# EasyEDA Pro project MyWeld-ESP32.eprj

# Schematic Sheet1-ascii
Board Name: Sheet1-ascii; Create Date: 2026-03-16; Page Name: Sheet1-with-IR4427; Project Name: MyWeld-ESP32; Schematic Name: Sheet1-ascii; Update Date: 2026-03-17; Address1: *; Address2: *; Address3: *; Address4: *; Application_BuildNumber: *; ApprovedBy: *; Author: Hisham2630; CheckedBy: *; CompanyName: *; CurrentDate: *; CurrentTime: *; Date: *; DocumentFullPathAndName: *; DocumentName: *; DocumentNumber: *; DrawnBy: Hisham2630; Engineer: Hisham2630; ImagePath: *; ModifiedDate: *; Organization: *; ProjectName: *; Revision: A; Rule: *; SheetNumber: 1; SheetTotal: 1; Time: *; Title: DIY Supercapacitor Spot Welder – Inspired by AKA KASYAN, Modified Design
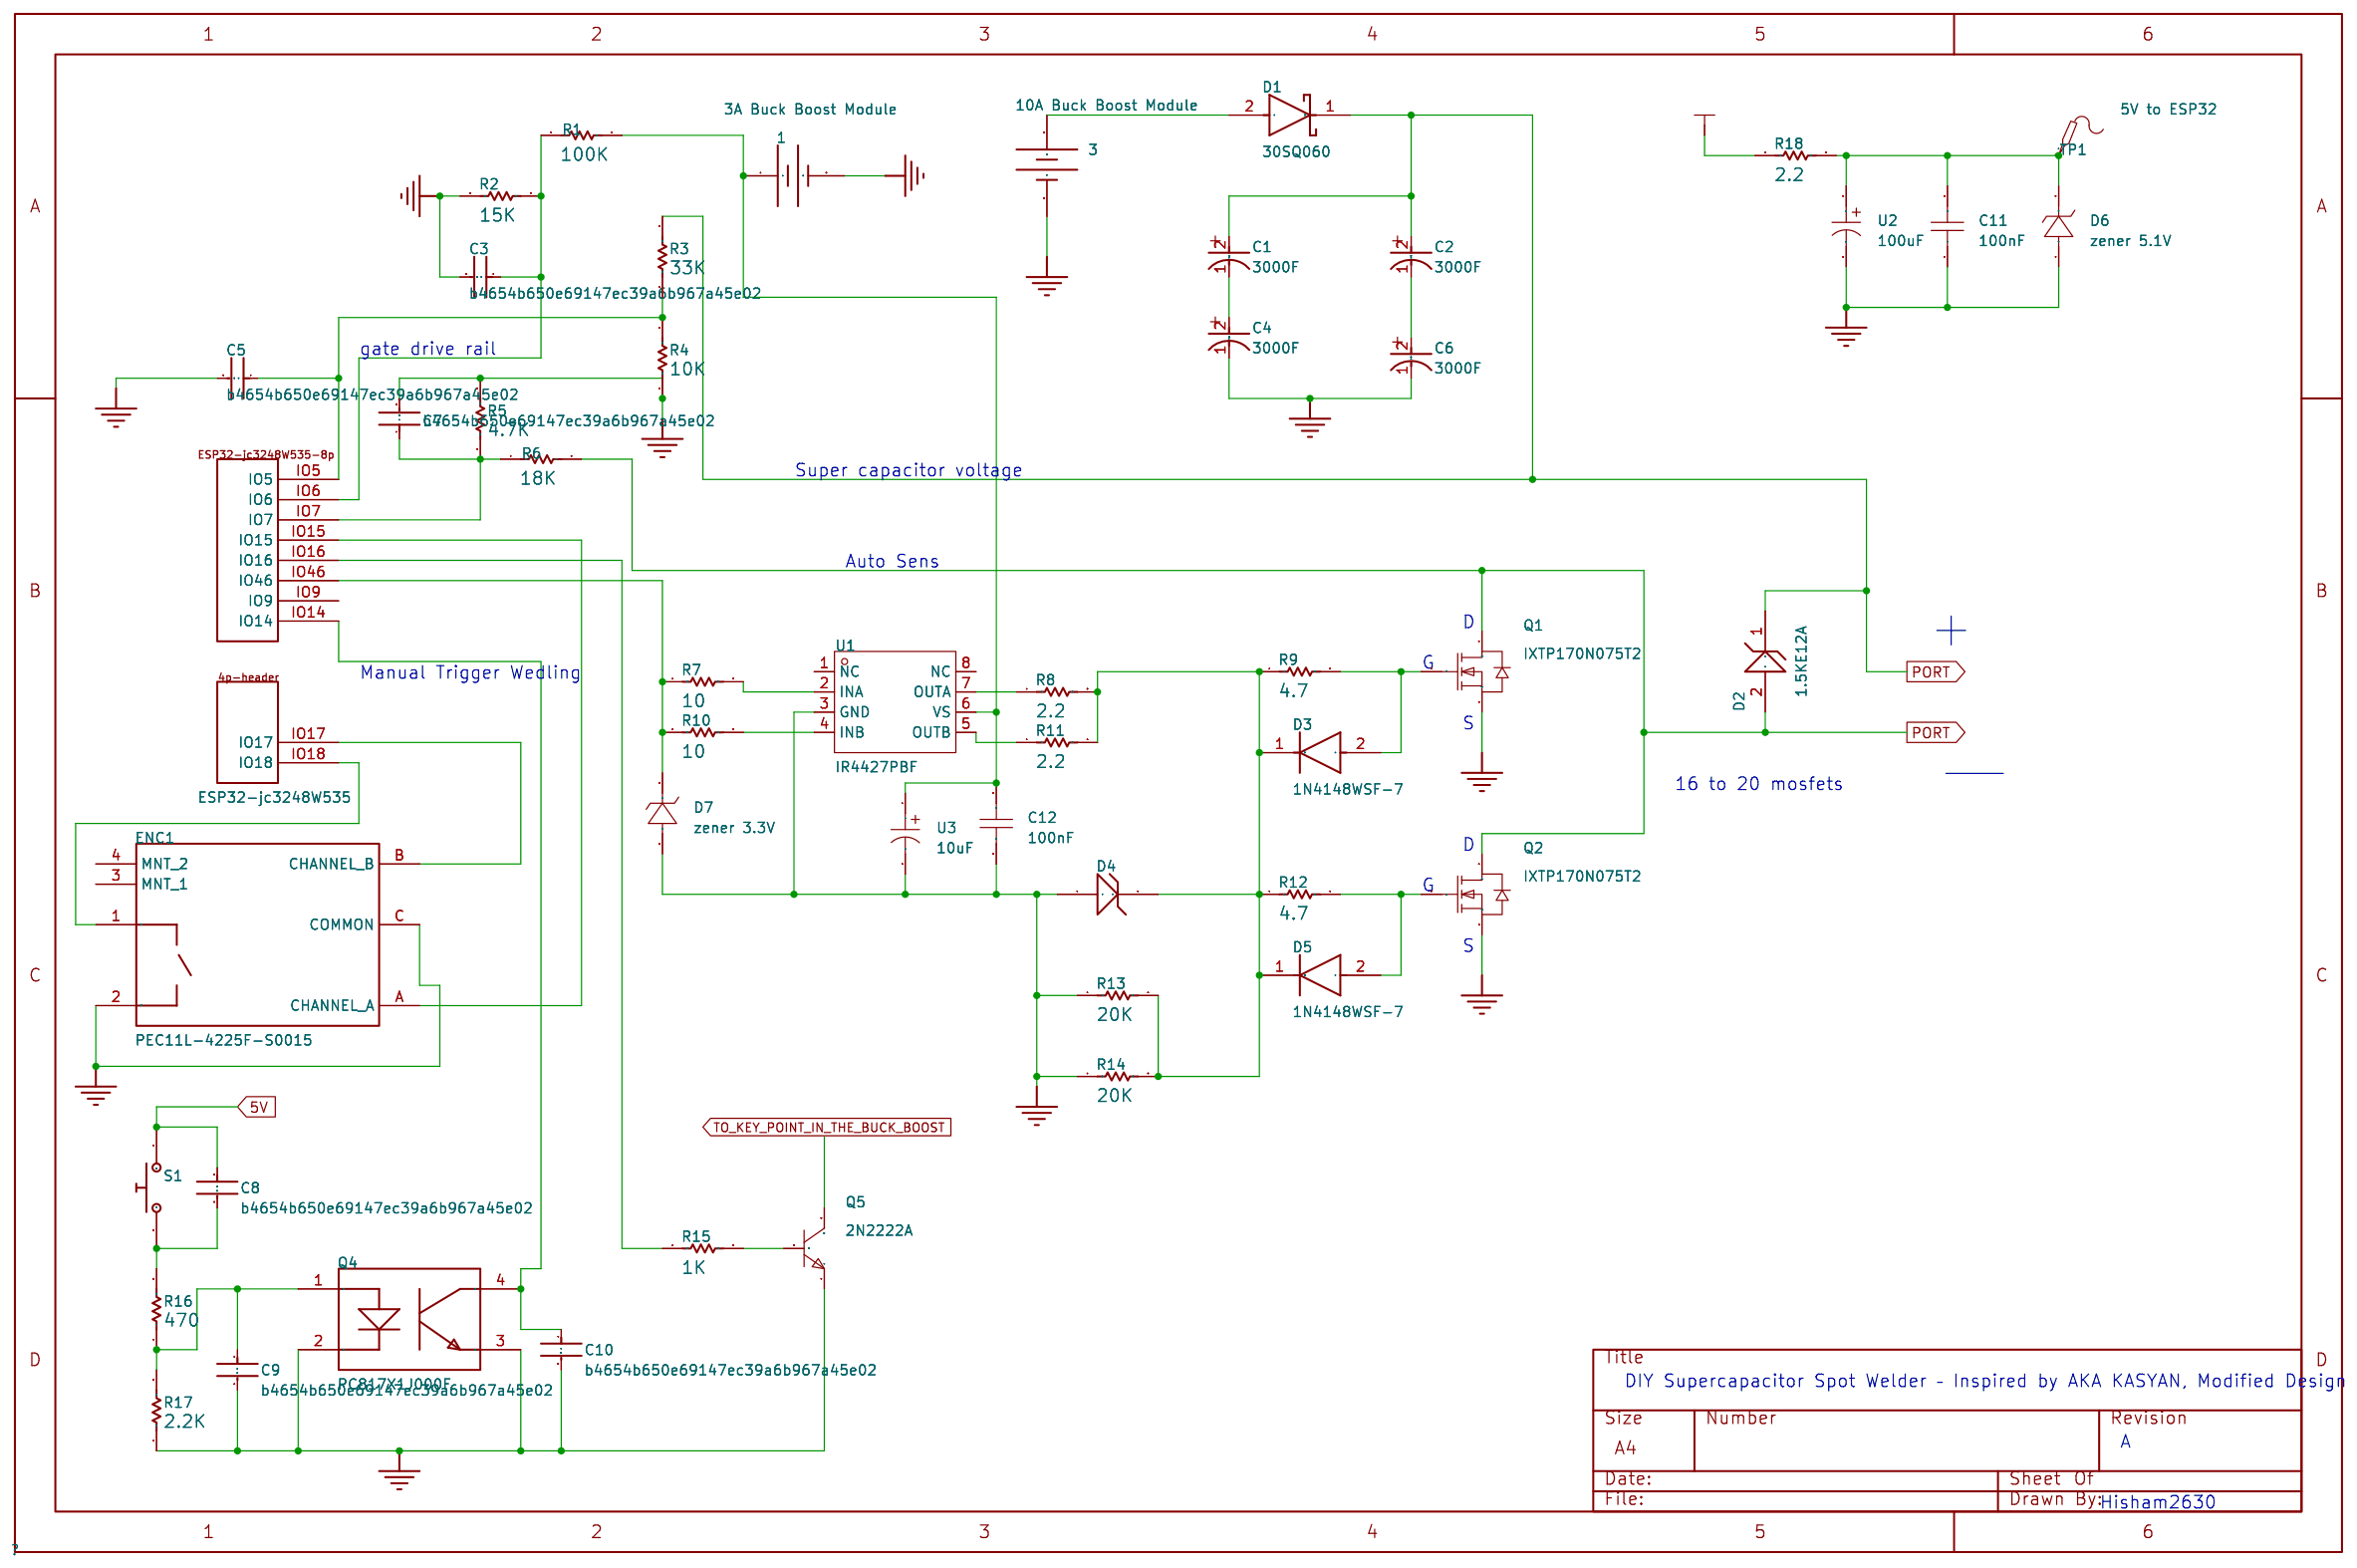
[diagram p0: schematic sheet]

## Parts
1  3A Buck Boost Module
3  10A Buck Boost Module
*1  ESP32-jc3248W535
C1  0.47F
C2  0.47F
C3  b4654b650e69147ec39a6b967a45e02
C4  0.47F
C5  b4654b650e69147ec39a6b967a45e02
C6  0.47F
C7  b4654b650e69147ec39a6b967a45e02
C8  b4654b650e69147ec39a6b967a45e02
C9  b4654b650e69147ec39a6b967a45e02
C10  b4654b650e69147ec39a6b967a45e02
C11  100nF  [C0402]
C12  100nF  [C0402]
D1  30SQ060
D2  1.5KE12A
D3  1.5pF
D4  Zener Diode
D5  1.5pF
D6  zener 5.1V  [LL-34_L3.5-W1.5-R-RD]
D7  zener 3.3V  [LL-34_L3.5-W1.5-R-RD]
ENC1  PEC11L-4225F-S0015
Q1  IXTP170N075T2  [TO-220-3_L10.0-W4.5-P2.54-L-1]
Q2  IXTP170N075T2  [TO-220-3_L10.0-W4.5-P2.54-L-1]
Q4  PC817X1J000F
Q5  2N2222A  [TO-92-3_L4.5-W3.5-P1.27-L]
R1  100K
R2  15K
R3  33K
R4  10K
R5  4.7K
R6  18K
R7  10
R8  2.2
R9  4.7
R10  10
R11  2.2
R12  4.7
R13  20K
R14  20K
R15  1K
R16  470
R17  2.2K
R18  2.2
S1  Push Button Normally Opened
TP1  5V to ESP32  [Test-Point-0.5mm]
U1  IR4427PBF  [PDIP-8_L9.6-W6.4-P2.54-LS7.6-BL]
U2  100uF  [CAP-TH_BD10.0-P5.00-D0.6-FD]
U3  10uF  [CAP-TH_BD10.0-P5.00-D0.6-FD]

## Library data of the parts
1 = 3A Buck Boost Module: Constant Voltage Source; SimulationGenericComponent: True; DC Magnitude: 16V; Design Item ID: Battery; Library Name: Simulation Generic Components
3 = 10A Buck Boost Module: Constant Voltage Source; SimulationGenericComponent: True; DC Magnitude: 5.7V; Design Item ID: Battery; Library Name: Simulation Generic Components
*1 = ESP32-jc3248W535: Library Name: esp32-jc3248W535
C1 C2 C4 C6 = 3000F: CAP 470MF -20% +80% 5.5V T/H; Octopart: https://octopart.com/ft0h474zf-kemet-30531665; Manufacturer: KEMET; Automotive: No; Device Class L3: Supercapacitors; Digikey Description: CAP 470MF -20% +80% 5.5V T/H; ComponentLink2Description: Datasheet; ComponentLink2URL: https://content.kemet.com/datasheets/KEM_S6014_FT.pdf; Device Class L1: Passive Components; Tolerance: -20/+80%; Manufacturer Part Number: FT0H474ZF; Height: 13mm; Category: Cap; RoHS: TRUE; Lead Free: Yes; Temperature Range Low: -40°C; Temperature: -40°C to +85°C; Voltage Rating: 5.5V; Device Class L2: Capacitors; Package1: FT0H474ZF; Mouser Description: Supercapacitors / Ultracapacitors 0.47F 5.5volts Radial Super Cap; Temperature Range High: +85°C; Design Item ID: CMP-03024-000001-1; Library Name: Altium Content Vault; Datasheet: https://content.kemet.com/datasheets/KEM_S6014_FT.pdf
C3 C5 C7-C10 = b4654b650e69147ec39a6b967a45e02: Chip Multilayer Ceramic Capacitors for General Purpose, 0201, 0.10uF, X5R, 15%, 10%, 10V; Mount: Surface Mount; Dielectric: X5R; Width: 0.012inch; Tolerance: 10%; Radiation Hardening: No; Voltage Rating: 10V; REACH SVHC: No SVHC; Height: 0.3mm; Max Operating Temperature: 85°C; Voltage Rating (DC): 10V; Capacitance: 100nF; Thickness: 0.013inch; Termination: SMD/SMT; Lead Free: Lead Free; Package Quantity: 1; Case/Package: 0201; Min Operating Temperature: -55°C; Weight: 6E-06oz; Length: 0.6mm; Case Code (Imperial): 0201; Depth: 0.3mm; Voltage: 10V; Packaging: Tape and Reel; Case Code (Metric): 0603; Origin Footprint 1: FP-GRM033-0_03-MFG; Origin Footprint 2: FP-GRM033-0_03-IPC_B; Origin Footprint 3: FP-GRM033-0_03-IPC_A; Design Item ID: CMP-2010-01264-2; Library Name: Altium Content Vault
C11 C12 = CL05B104KB54PNC: LCSC Part Name: 100nF ±10% 50V; Supplier Part: C307331; Manufacturer: SAMSUNG(三星); Supplier Footprint: 0402; JLCPCB Part Class: Basic Part; Datasheet: https://item.szlcsc.com/datasheet/CL05B104KB54PNC/291005.html; Supplier: LCSC; Tolerance: ±10%; Voltage Rating: 50V; Temperature Coefficient: X7R
D1 = 30SQ060: DIODE SCHOTTKY 20V 1A SMAF; Average Rectified Current: 1A; Packaging: Tape and Reel; Mount: Surface Mount; Max Reverse Voltage (DC): 20V; RoHS Compliant: Yes; Design Item ID: CMP-12790-000092-1; Library Name: Altium Content Vault
D2 = 1.5KE12A: TVS diode [Würth Elektronik] 824520700 TVS diode; Packaging: Cut Tape; Min Breakdown Voltage: 8.19V; Length: 4.32mm; Number of Pins: 2; Width: 3.62mm; Height: 2.4mm; REACH SVHC: Unknown; Breakdown Voltage: 8.19V; Peak Pulse Current: 50A; RoHS: Compliant; Composition: Zener; Reverse Standoff Voltage: 7V; Power Line Protection: No; Number of Unidirectional Channels: 1; Mount: Surface Mount; Polarity: Unidirectional; Peak Pulse Power: 600W; Max Operating Temperature: 150°C; Min Operating Temperature: -65°C; Max Breakdown Voltage: 8.19V; Leakage Current: 200µA; Clamping Voltage: 12V; Design Item ID: CMP-03913-71101605-2; Library Name: Altium Content Vault
D3 D5 = 1N4148WSF-7: DIODE GEN PURP 100V 250MA SOD323; Height: 0.75mm; Digikey Description: DIODE GEN PURP 100V 250MA SOD323; Automotive: No; Footprint Url: https://www.diodes.com/assets/Package-Files/SOD323F.pdf; Category: Diode; Max Repetitive Reverse Voltage: 100V; Lead Free: Yes; Temperature Range High: +150°C; Forward Current: 250mA; Reverse Voltage: 100V; Device Class L3: Rectifier Diodes; ComponentLink2URL: https://www.diodes.com/assets/Datasheets/1N4148WSF.pdf; Package1: SOD323F; Manufacturer: Diodes Inc.; RoHS: TRUE; Mouser Description: Diodes - General Purpose, Power, Switching 200mW 2pF 75Vrrm 150mA 2A 1VF; Temperature: -55°C to +150°C; Max Surge Forward Current: 0.5A; Device Class L2: Diodes; ComponentLink2Description: Datasheet; Device Class L1: Discrete Semiconductors; Octopart: https://octopart.com/1n4148wsf-7-diodes+inc.-33798544; Peak Reverse Current: 0.5uA; Max Junction Temp: +150°C; Temperature Range Low: -55°C; Design Item ID: CMP-12791-000029-1; Library Name: Altium Content Vault; Datasheet: https://www.diodes.com/assets/Datasheets/1N4148WSF.pdf
D4 = Zener Diode: AF: 1; BV_MAX: 1e99; CJO: 0; CJP: 0; CTA: 0; CTP: 0; EG: 1.11; FC: 0.5; FCS: 0.5; FV_MAX: 1e99; IBV: 0.001; IKF: 0; IKR: 0; IS: 1e-14; ISR: 1e-14; JSW: 0; JTUN: 0; JTUNSW: 0; KEG: 1; KF: 0; LEVEL: 1; MJSW: 0.33; N: 1; NBV: 1; NR: 1; NS: 1; NTUN: 30; PHP: 1; RS: 0; TCV: 0; TLEV: 0; TLEVC: 0; TM1: 0; TM2: 0; TNOM: 27; TPB: 0; TPHP: 0; TRS: 0; TRS2: 0; TT: 0; TTT1: 0; TTT2: 0; VJ: 1; XTI: 3; XTITUN: 3; SimulationGenericComponent: True; BV: 18V Zener; Library Name: Simulation Generic Components
D6 D7 = ZMM5V1PF-M: LCSC Part Name: 耐压:5.1V 电流:0.1uA@1V; Supplier Part: C7497480; Manufacturer: ST(先科); Supplier Footprint: LL-34; JLCPCB Part Class: Extended Part; Datasheet: https://item.szlcsc.com/datasheet/ZMM5V1PF-M/8566091.html; Supplier: LCSC; Zener Voltage(Nom): 5.1V; Reverse Leakage Current (Ir): 100nA@1V; Zener Voltage(Range): 4.8V~5.4V; Pd - Power Dissipation: 500mW; Impedance(Zzt): 35Ω; Impedance(Zzk): 550Ω
ENC1 = PEC11L-4225F-S0015: ROTARY ENCODER MECHANICAL 15PPR; Length: 29.5mm; Height: 12mm; RoHS Compliant: Yes; Capacitance: 4225F; Min Operating Temperature: -25°C; Pulses per Revolution: 15; Package Quantity: 75; Built in Switch: Yes; Detent: Yes; Encoder Type: Mechanical; Mount: Through Hole; Number of Channels: 2; Max Operating Temperature: 80°C; Orientation: Vertical; Output Type: Quadrature; Termination: PC Pin; Width: 11.8mm; Packaging: Bulk; Design Item ID: CMP-07421-000017-1; Library Name: Altium Content Vault
Q1 Q2 = IXTP170N075T2: Supplier Part: C22419309; Manufacturer: Littelfuse/IXYS; Supplier Footprint: TO-220; JLCPCB Part Class: Extended Part; Datasheet: https://item.szlcsc.com/datasheet/IXTP170N075T2/24042949.html; Supplier: LCSC
Q4 = PC817X1J000F: OPTOISOLATOR 5KV TRANS 4DIP; Collector Emitter Saturation Voltage: 200mV; Min Operating Temperature: -30°C; Number of Pins: 4; Forward Voltage: 1.4V; Radiation Hardening: No; Power Dissipation: 200mW; Input Current: 20mA; Max Collector Current: 50mA; Collector Emitter Breakdown Voltage: 80V; Output Current per Channel: 50mA; Rise Time: 18000ns; Case/Package: DIP; Fall Time: 18000ns; Forward Current: 50mA; Isolation Voltage: 5kV; Number of Elements: 1; Package Quantity: 2000; Reverse Breakdown Voltage: 6V; Max Operating Temperature: 100°C; Packaging: Sleeve; Max Input Current: 50mA; Output Voltage: 80V; Max Power Dissipation: 200mW; Mount: Through Hole; Current Transfer Ratio: 600%; Number of Channels: 1; Collector Emitter Voltage (VCEO): 80V; Design Item ID: CMP-65434-000003-1; Library Name: Altium Content Vault
Q5 = 2N2222A_C20616319: LCSC Part Name: NPN 600mA 40V; Supplier Part: C20616319; Manufacturer: HXY MOSFET(华轩阳电子); Supplier Footprint: TO-92; JLCPCB Part Class: Extended Part; Datasheet: https://item.szlcsc.com/datasheet/2N2222A/21982678.html; Supplier: LCSC; type: NPN; Current - Collector(Ic): 600mA; Collector - Emitter Voltage VCEO: 40V; Pd - Power Dissipation: 625mW; DC Current Gain: 300@150mA,10V; Transition frequency(fT): 300MHz; Current - Collector Cutoff: 10nA; Vce Saturation(VCE(sat)): 600mV@500mA,50mA; Operating Temperature: -55℃~+150℃; Emitter-Base Voltage(Vebo): 6V; Number: 1 NPN
R1-R18 = Resistor: TC1: 0; TC2: 0; SimulationGenericComponent: True; Library Name: Simulation Generic Components
S1 = Push Button Normally Opened: closed: 0; Rclosed: 1m; Ropen: 1Meg; SimulationGenericComponent: True; Design Item ID: Push Button NO; Library Name: Simulation Generic Components
TP1 = Test-Point
U1 = IR4427PBF: Supplier Part: C1549365; Manufacturer: Infineon(英飞凌); Supplier Footprint: PDIP-8; JLCPCB Part Class: Extended Part; Datasheet: https://atta.szlcsc.com/upload/public/pdf/source/20200522/C537736_3DC1FE819CD879B59A475D2024F6FF95.pdf; Supplier: LCSC; Driven Configuration: 低边; Load Type: MOSFET；IGBT; Number of Drivers: 2; Peak Output Current(sink): 3.3A; Peak Output Current(source): 2.3A; Supply Voltage: 6V~20V; Rise Time: 15ns; Fall Time: 10ns; Operating Temperature: -40℃~+150℃@(Tj)
U2 U3 = 1000uF 16V: Supplier Part: C439782; Manufacturer: Chengx(承兴); Supplier Footprint: 插件,D10xL13mm; JLCPCB Part Class: Extended Part; Datasheet: https://item.szlcsc.com/datasheet/1000uF%252016V/438882.html; Supplier: LCSC; Voltage Rating: 16V; Ripple Current: 680mA@120Hz; Pin Spacing: 5mm; Diameter: 10mm; Height - Seated (Max): 13mm; Lifetime: 2000hrs@105℃; Operating Temperature: -40℃~+105℃

## Nets
5V: C8.1 S1.2
GND: 1.2 3.2 C3.2 C4.1(C) C5.2 C6.1(C) C7.2 C9.2 C10.2 C11.1 C12.1 D4.1(A) D6.1(A) D7.1(A) ENC1.2 ENC1.C(COMMON) Q1.3(S) Q2.3(S) Q4.2(C) Q4.3(E) Q5.1(E) R2.2 R4.1 R5.2 R13.1 R14.1 R17.1 U1.3(GND) U2.2 U3.2
VCC-5V-BUCKBOOST: R18.1
PORT: C1.2(A) C2.2(A) D1.1(C) D2.1(K) D2.2(A) Q1.2(D) Q2.2(D) R3.2 R6.2
Net-(1-1): 1.1 C12.2 R1.2 U1.6(VS) U3.1
Net-(3-1): 3.1 D1.2(A)
Net-(*1-IO5): *1.IO5 C5.1 R3.1 R4.2
Net-(*1-IO6): *1.IO6 C3.1 R1.1 R2.1
Net-(*1-IO7): *1.IO7 C7.1 R5.1 R6.1
Net-(*1-IO14): *1.IO14 C10.1 Q4.4(C)
Net-(*1-IO15): *1.IO15 ENC1.A(CHANNEL A)
Net-(*1-IO16): *1.IO16 R15.1
Net-(*1-IO17): *1.IO17 ENC1.B(CHANNEL B)
Net-(*1-IO18): *1.IO18 ENC1.1
Net-(*1-IO46): *1.IO46 D7.2(K) R7.1 R10.1
Net-(C1-1): C1.1(C) C4.2(A)
Net-(C2-1): C2.1(C) C6.2(A)
Net-(C8-2): C8.2 R16.2 S1.1
Net-(C9-1): C9.1 Q4.1(A) R16.1 R17.2
Net-(C11-2): C11.2 D6.2(K) R18.2 TP1.1 U2.1
Net-(D3-1): D3.1(C) D4.2(K) D5.1(C) R8.2 R9.1 R11.2 R12.1 R13.2 R14.2
Net-(D3-2): D3.2(A) Q1.1(G) R9.2
Net-(D5-2): D5.2(A) Q2.1(G) R12.2
Net-(Q5-2): Q5.2(B) R15.2
Net-(R7-2): R7.2 U1.2(INA)
Net-(R8-1): R8.1 U1.7(OUTA)
Net-(R10-2): R10.2 U1.4(INB)
Net-(R11-1): R11.1 U1.5(OUTB)

Not connected (* = marked no-connect by the designer): *1 IO9; ENC1 3(MNT 1) 4(MNT 2); Q5 3(C); U1 1(NC) 8(NC)

## Notes on the sheet
- gate drive rail
- Super capacitor voltage
- Auto Sens
- D
- +
- Manual Trigger Wedling
- G
- S
- 16 to 20 mosfets
- -
- D
- G
- S
- DIY Supercapacitor Spot Welder – Inspired by AKA KASYAN, Modified Design
- A
- Hisham2630

# Schematic Schematic1
Create Date: 2026-03-17; Page Name: Sheet1-with-TLP358; Project Name: MyWeld-ESP32; Schematic Name: Schematic1; Update Date: 2026-03-17; Address1: *; Address2: *; Address3: *; Address4: *; Application_BuildNumber: *; ApprovedBy: *; Author: Hisham2630; CheckedBy: *; CompanyName: *; CurrentDate: *; CurrentTime: *; Date: *; DocumentFullPathAndName: *; DocumentName: *; DocumentNumber: *; DrawnBy: Hisham2630; Engineer: Hisham2630; ImagePath: *; ModifiedDate: *; Organization: *; ProjectName: *; Revision: A; Rule: *; SheetNumber: 1; SheetTotal: 1; Time: *; Title: DIY Supercapacitor Spot Welder – Inspired by AKA KASYAN, Modified Design
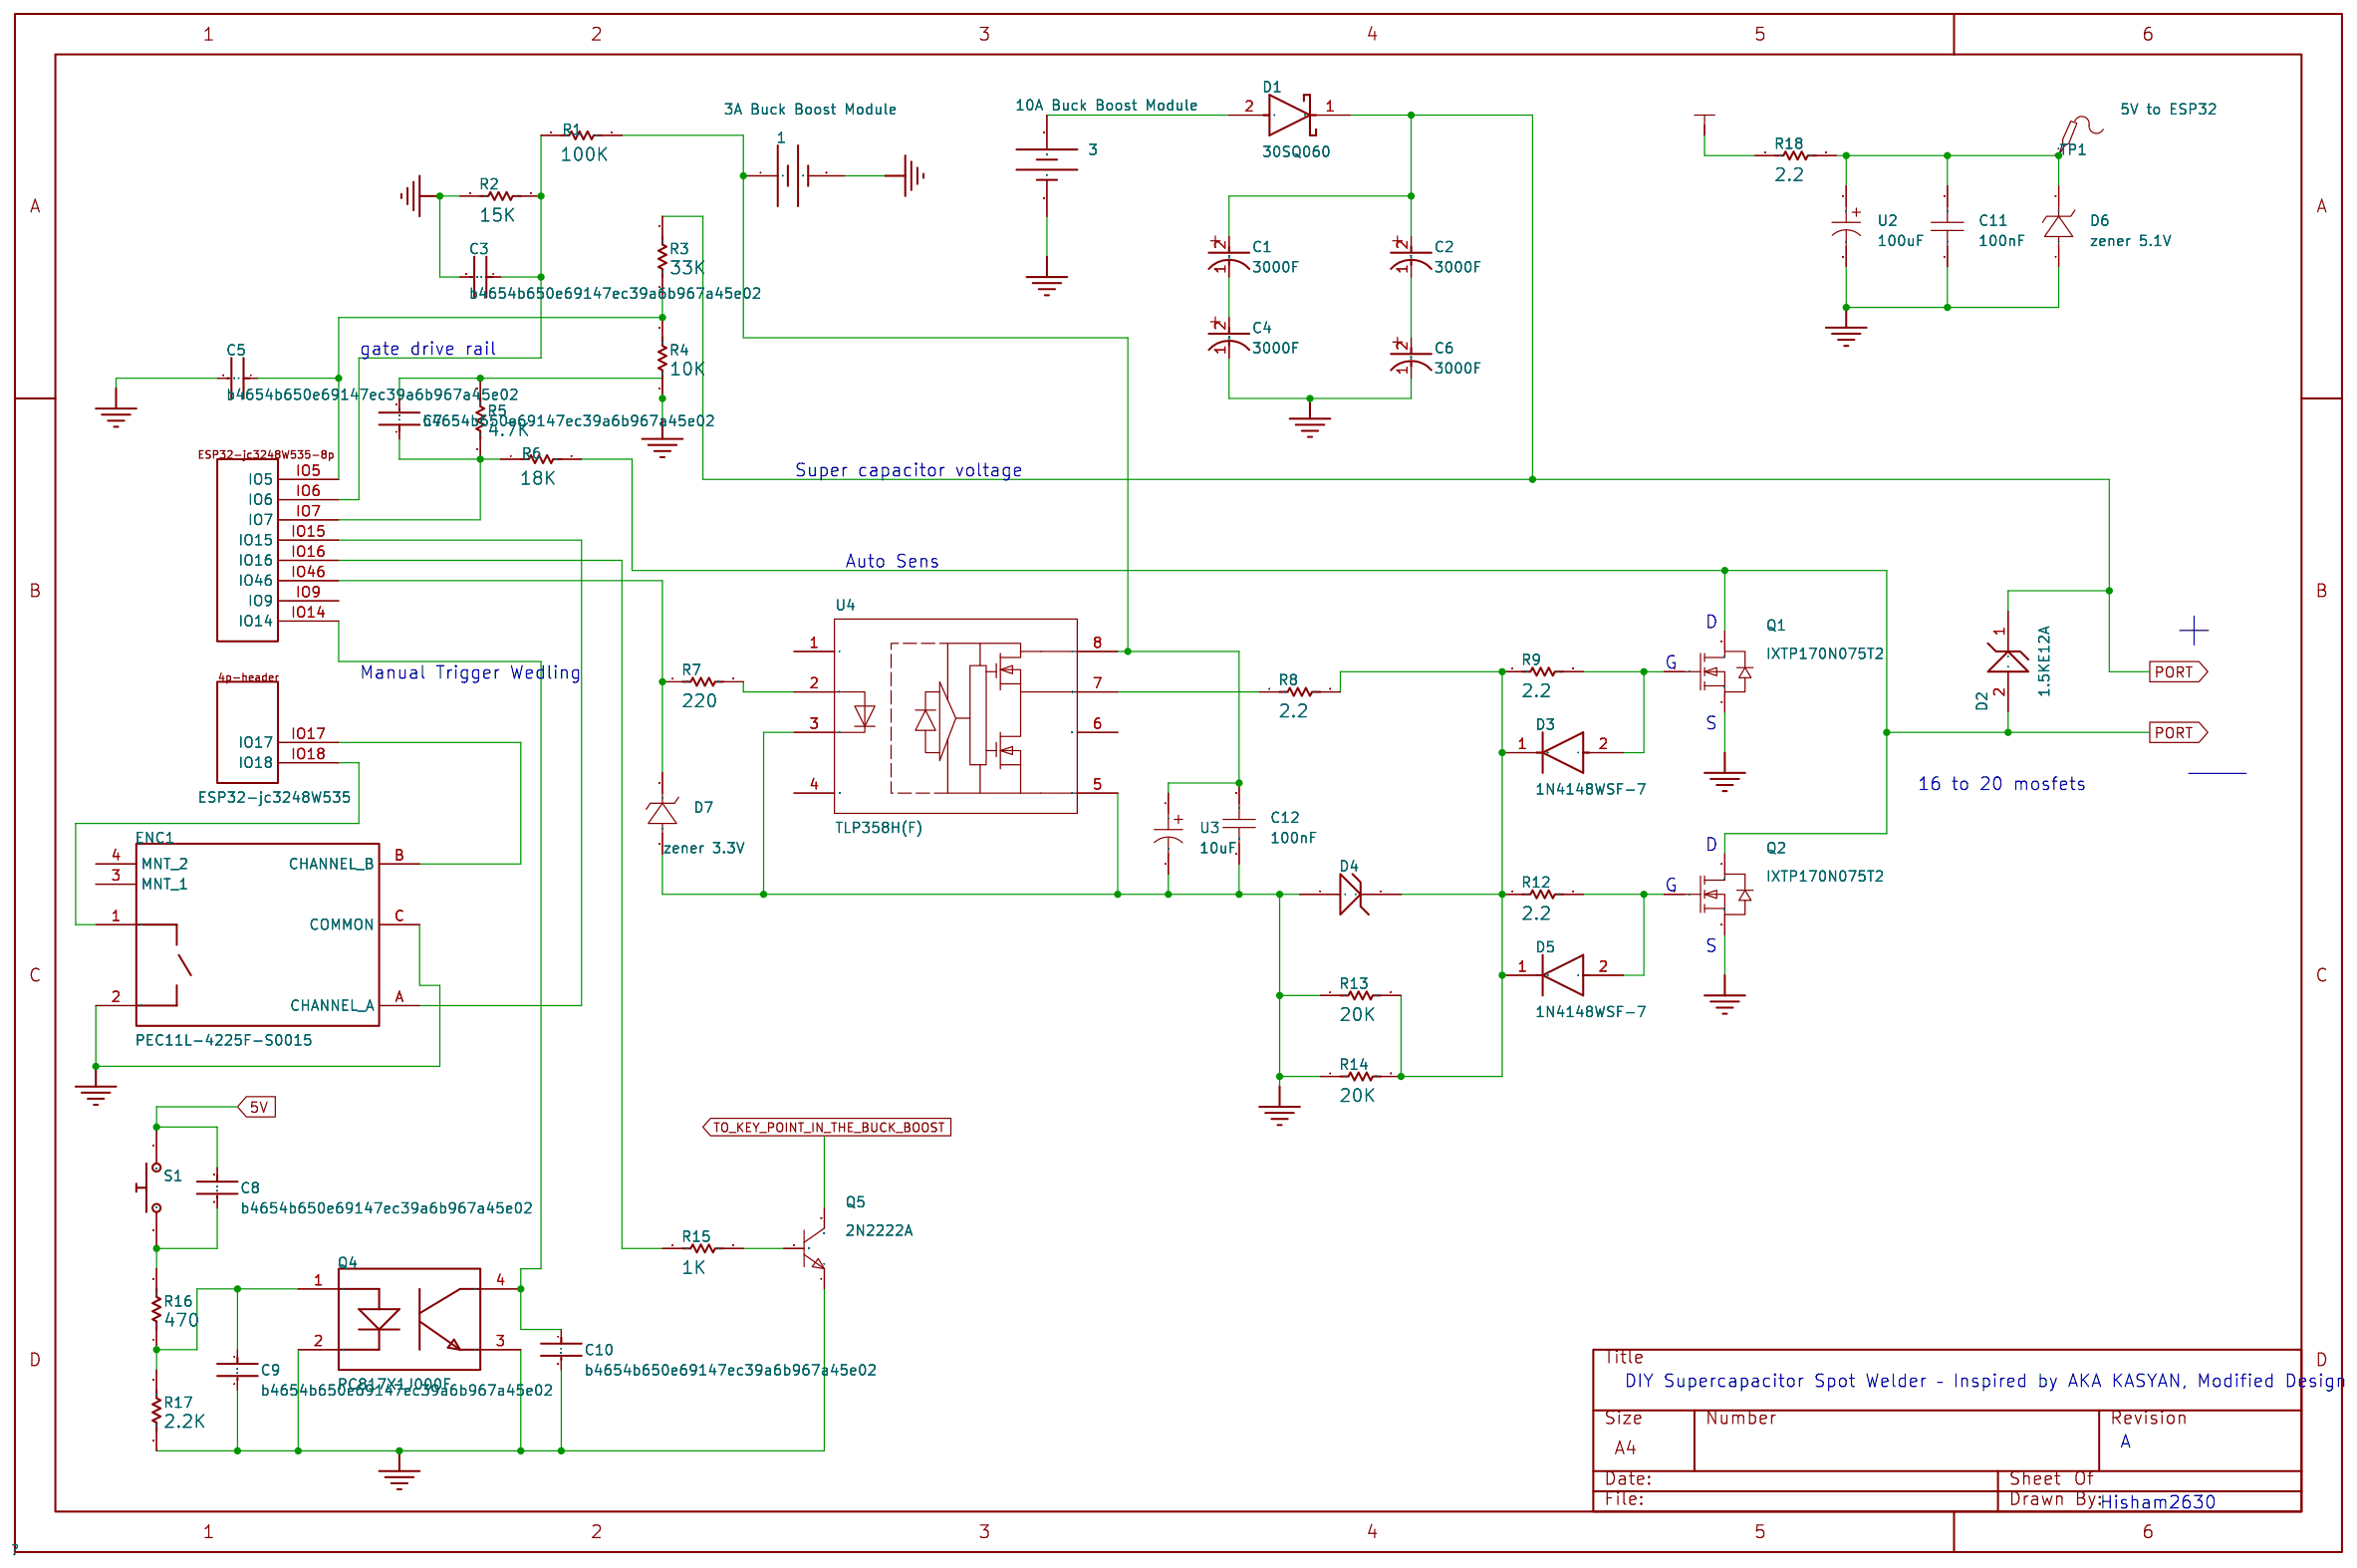
[diagram p1: schematic sheet]

## Parts
1  3A Buck Boost Module
3  10A Buck Boost Module
*1  ESP32-jc3248W535
C1  0.47F
C2  0.47F
C3  b4654b650e69147ec39a6b967a45e02
C4  0.47F
C5  b4654b650e69147ec39a6b967a45e02
C6  0.47F
C7  b4654b650e69147ec39a6b967a45e02
C8  b4654b650e69147ec39a6b967a45e02
C9  b4654b650e69147ec39a6b967a45e02
C10  b4654b650e69147ec39a6b967a45e02
C11  100nF  [C0402]
C12  100nF  [C0402]
D1  30SQ060
D2  1.5KE12A
D3  1.5pF
D4  Zener Diode
D5  1.5pF
D6  zener 5.1V  [LL-34_L3.5-W1.5-R-RD]
D7  zener 3.3V  [LL-34_L3.5-W1.5-R-RD]
ENC1  PEC11L-4225F-S0015
Q1  IXTP170N075T2  [TO-220-3_L10.0-W4.5-P2.54-L-1]
Q2  IXTP170N075T2  [TO-220-3_L10.0-W4.5-P2.54-L-1]
Q4  PC817X1J000F
Q5  2N2222A  [TO-92-3_L4.5-W3.5-P1.27-L]
R1  100K
R2  15K
R3  33K
R4  10K
R5  4.7K
R6  18K
R7  220
R8  2.2
R9  2.2
R12  2.2
R13  20K
R14  20K
R15  1K
R16  470
R17  2.2K
R18  2.2
S1  Push Button Normally Opened
TP1  5V to ESP32  [Test-Point-0.5mm]
U2  100uF  [CAP-TH_BD10.0-P5.00-D0.6-FD]
U3  10uF  [CAP-TH_BD10.0-P5.00-D0.6-FD]
U4  TLP358H(F)  [DIP-8_L9.7-W6.4-P2.54-LS10.2-BL]

## Library data of the parts
1 = 3A Buck Boost Module: Constant Voltage Source; SimulationGenericComponent: True; DC Magnitude: 16V; Design Item ID: Battery; Library Name: Simulation Generic Components
3 = 10A Buck Boost Module: Constant Voltage Source; SimulationGenericComponent: True; DC Magnitude: 5.7V; Design Item ID: Battery; Library Name: Simulation Generic Components
*1 = ESP32-jc3248W535: Library Name: esp32-jc3248W535
C1 C2 C4 C6 = 3000F: CAP 470MF -20% +80% 5.5V T/H; Octopart: https://octopart.com/ft0h474zf-kemet-30531665; Manufacturer: KEMET; Automotive: No; Device Class L3: Supercapacitors; Digikey Description: CAP 470MF -20% +80% 5.5V T/H; ComponentLink2Description: Datasheet; ComponentLink2URL: https://content.kemet.com/datasheets/KEM_S6014_FT.pdf; Device Class L1: Passive Components; Tolerance: -20/+80%; Manufacturer Part Number: FT0H474ZF; Height: 13mm; Category: Cap; RoHS: TRUE; Lead Free: Yes; Temperature Range Low: -40°C; Temperature: -40°C to +85°C; Voltage Rating: 5.5V; Device Class L2: Capacitors; Package1: FT0H474ZF; Mouser Description: Supercapacitors / Ultracapacitors 0.47F 5.5volts Radial Super Cap; Temperature Range High: +85°C; Design Item ID: CMP-03024-000001-1; Library Name: Altium Content Vault; Datasheet: https://content.kemet.com/datasheets/KEM_S6014_FT.pdf
C3 C5 C7-C10 = b4654b650e69147ec39a6b967a45e02: Chip Multilayer Ceramic Capacitors for General Purpose, 0201, 0.10uF, X5R, 15%, 10%, 10V; Mount: Surface Mount; Dielectric: X5R; Width: 0.012inch; Tolerance: 10%; Radiation Hardening: No; Voltage Rating: 10V; REACH SVHC: No SVHC; Height: 0.3mm; Max Operating Temperature: 85°C; Voltage Rating (DC): 10V; Capacitance: 100nF; Thickness: 0.013inch; Termination: SMD/SMT; Lead Free: Lead Free; Package Quantity: 1; Case/Package: 0201; Min Operating Temperature: -55°C; Weight: 6E-06oz; Length: 0.6mm; Case Code (Imperial): 0201; Depth: 0.3mm; Voltage: 10V; Packaging: Tape and Reel; Case Code (Metric): 0603; Origin Footprint 1: FP-GRM033-0_03-MFG; Origin Footprint 2: FP-GRM033-0_03-IPC_B; Origin Footprint 3: FP-GRM033-0_03-IPC_A; Design Item ID: CMP-2010-01264-2; Library Name: Altium Content Vault
C11 C12 = CL05B104KB54PNC: LCSC Part Name: 100nF ±10% 50V; Supplier Part: C307331; Manufacturer: SAMSUNG(三星); Supplier Footprint: 0402; JLCPCB Part Class: Basic Part; Datasheet: https://item.szlcsc.com/datasheet/CL05B104KB54PNC/291005.html; Supplier: LCSC; Tolerance: ±10%; Voltage Rating: 50V; Temperature Coefficient: X7R
D1 = 30SQ060: DIODE SCHOTTKY 20V 1A SMAF; Average Rectified Current: 1A; Packaging: Tape and Reel; Mount: Surface Mount; Max Reverse Voltage (DC): 20V; RoHS Compliant: Yes; Design Item ID: CMP-12790-000092-1; Library Name: Altium Content Vault
D2 = 1.5KE12A: TVS diode [Würth Elektronik] 824520700 TVS diode; Packaging: Cut Tape; Min Breakdown Voltage: 8.19V; Length: 4.32mm; Number of Pins: 2; Width: 3.62mm; Height: 2.4mm; REACH SVHC: Unknown; Breakdown Voltage: 8.19V; Peak Pulse Current: 50A; RoHS: Compliant; Composition: Zener; Reverse Standoff Voltage: 7V; Power Line Protection: No; Number of Unidirectional Channels: 1; Mount: Surface Mount; Polarity: Unidirectional; Peak Pulse Power: 600W; Max Operating Temperature: 150°C; Min Operating Temperature: -65°C; Max Breakdown Voltage: 8.19V; Leakage Current: 200µA; Clamping Voltage: 12V; Design Item ID: CMP-03913-71101605-2; Library Name: Altium Content Vault
D3 D5 = 1N4148WSF-7: DIODE GEN PURP 100V 250MA SOD323; Height: 0.75mm; Digikey Description: DIODE GEN PURP 100V 250MA SOD323; Automotive: No; Footprint Url: https://www.diodes.com/assets/Package-Files/SOD323F.pdf; Category: Diode; Max Repetitive Reverse Voltage: 100V; Lead Free: Yes; Temperature Range High: +150°C; Forward Current: 250mA; Reverse Voltage: 100V; Device Class L3: Rectifier Diodes; ComponentLink2URL: https://www.diodes.com/assets/Datasheets/1N4148WSF.pdf; Package1: SOD323F; Manufacturer: Diodes Inc.; RoHS: TRUE; Mouser Description: Diodes - General Purpose, Power, Switching 200mW 2pF 75Vrrm 150mA 2A 1VF; Temperature: -55°C to +150°C; Max Surge Forward Current: 0.5A; Device Class L2: Diodes; ComponentLink2Description: Datasheet; Device Class L1: Discrete Semiconductors; Octopart: https://octopart.com/1n4148wsf-7-diodes+inc.-33798544; Peak Reverse Current: 0.5uA; Max Junction Temp: +150°C; Temperature Range Low: -55°C; Design Item ID: CMP-12791-000029-1; Library Name: Altium Content Vault; Datasheet: https://www.diodes.com/assets/Datasheets/1N4148WSF.pdf
D4 = Zener Diode: AF: 1; BV_MAX: 1e99; CJO: 0; CJP: 0; CTA: 0; CTP: 0; EG: 1.11; FC: 0.5; FCS: 0.5; FV_MAX: 1e99; IBV: 0.001; IKF: 0; IKR: 0; IS: 1e-14; ISR: 1e-14; JSW: 0; JTUN: 0; JTUNSW: 0; KEG: 1; KF: 0; LEVEL: 1; MJSW: 0.33; N: 1; NBV: 1; NR: 1; NS: 1; NTUN: 30; PHP: 1; RS: 0; TCV: 0; TLEV: 0; TLEVC: 0; TM1: 0; TM2: 0; TNOM: 27; TPB: 0; TPHP: 0; TRS: 0; TRS2: 0; TT: 0; TTT1: 0; TTT2: 0; VJ: 1; XTI: 3; XTITUN: 3; SimulationGenericComponent: True; BV: 18V Zener; Library Name: Simulation Generic Components
D6 D7 = ZMM5V1PF-M: LCSC Part Name: 耐压:5.1V 电流:0.1uA@1V; Supplier Part: C7497480; Manufacturer: ST(先科); Supplier Footprint: LL-34; JLCPCB Part Class: Extended Part; Datasheet: https://item.szlcsc.com/datasheet/ZMM5V1PF-M/8566091.html; Supplier: LCSC; Zener Voltage(Nom): 5.1V; Reverse Leakage Current (Ir): 100nA@1V; Zener Voltage(Range): 4.8V~5.4V; Pd - Power Dissipation: 500mW; Impedance(Zzt): 35Ω; Impedance(Zzk): 550Ω
ENC1 = PEC11L-4225F-S0015: ROTARY ENCODER MECHANICAL 15PPR; Length: 29.5mm; Height: 12mm; RoHS Compliant: Yes; Capacitance: 4225F; Min Operating Temperature: -25°C; Pulses per Revolution: 15; Package Quantity: 75; Built in Switch: Yes; Detent: Yes; Encoder Type: Mechanical; Mount: Through Hole; Number of Channels: 2; Max Operating Temperature: 80°C; Orientation: Vertical; Output Type: Quadrature; Termination: PC Pin; Width: 11.8mm; Packaging: Bulk; Design Item ID: CMP-07421-000017-1; Library Name: Altium Content Vault
Q1 Q2 = IXTP170N075T2: Supplier Part: C22419309; Manufacturer: Littelfuse/IXYS; Supplier Footprint: TO-220; JLCPCB Part Class: Extended Part; Datasheet: https://item.szlcsc.com/datasheet/IXTP170N075T2/24042949.html; Supplier: LCSC
Q4 = PC817X1J000F: OPTOISOLATOR 5KV TRANS 4DIP; Collector Emitter Saturation Voltage: 200mV; Min Operating Temperature: -30°C; Number of Pins: 4; Forward Voltage: 1.4V; Radiation Hardening: No; Power Dissipation: 200mW; Input Current: 20mA; Max Collector Current: 50mA; Collector Emitter Breakdown Voltage: 80V; Output Current per Channel: 50mA; Rise Time: 18000ns; Case/Package: DIP; Fall Time: 18000ns; Forward Current: 50mA; Isolation Voltage: 5kV; Number of Elements: 1; Package Quantity: 2000; Reverse Breakdown Voltage: 6V; Max Operating Temperature: 100°C; Packaging: Sleeve; Max Input Current: 50mA; Output Voltage: 80V; Max Power Dissipation: 200mW; Mount: Through Hole; Current Transfer Ratio: 600%; Number of Channels: 1; Collector Emitter Voltage (VCEO): 80V; Design Item ID: CMP-65434-000003-1; Library Name: Altium Content Vault
Q5 = 2N2222A_C20616319: LCSC Part Name: NPN 600mA 40V; Supplier Part: C20616319; Manufacturer: HXY MOSFET(华轩阳电子); Supplier Footprint: TO-92; JLCPCB Part Class: Extended Part; Datasheet: https://item.szlcsc.com/datasheet/2N2222A/21982678.html; Supplier: LCSC; type: NPN; Current - Collector(Ic): 600mA; Collector - Emitter Voltage VCEO: 40V; Pd - Power Dissipation: 625mW; DC Current Gain: 300@150mA,10V; Transition frequency(fT): 300MHz; Current - Collector Cutoff: 10nA; Vce Saturation(VCE(sat)): 600mV@500mA,50mA; Operating Temperature: -55℃~+150℃; Emitter-Base Voltage(Vebo): 6V; Number: 1 NPN
R1-R9 R12-R18 = Resistor: TC1: 0; TC2: 0; SimulationGenericComponent: True; Library Name: Simulation Generic Components
S1 = Push Button Normally Opened: closed: 0; Rclosed: 1m; Ropen: 1Meg; SimulationGenericComponent: True; Design Item ID: Push Button NO; Library Name: Simulation Generic Components
TP1 = Test-Point
U2 U3 = 1000uF 16V: Supplier Part: C439782; Manufacturer: Chengx(承兴); Supplier Footprint: 插件,D10xL13mm; JLCPCB Part Class: Extended Part; Datasheet: https://item.szlcsc.com/datasheet/1000uF%252016V/438882.html; Supplier: LCSC; Voltage Rating: 16V; Ripple Current: 680mA@120Hz; Pin Spacing: 5mm; Diameter: 10mm; Height - Seated (Max): 13mm; Lifetime: 2000hrs@105℃; Operating Temperature: -40℃~+105℃
U4 = TLP358H(F): Supplier Part: C20247643; Manufacturer: TOSHIBA(东芝); Supplier Footprint: DIP-8; JLCPCB Part Class: Extended Part; Datasheet: https://atta.szlcsc.com/upload/public/pdf/source/20240130/F4E2541522024368D81DBDD8579A4ABE.pdf; Supplier: LCSC

## Nets
5V: C8.1 S1.2
GND: 1.2 3.2 C3.2 C4.1(C) C5.2 C6.1(C) C7.2 C9.2 C10.2 C11.1 C12.1 D4.1(A) D6.1(A) D7.1(A) ENC1.2 ENC1.C(COMMON) Q1.3(S) Q2.3(S) Q4.2(C) Q4.3(E) Q5.1(E) R2.2 R4.1 R5.2 R13.1 R14.1 R17.1 U2.2 U3.2 U4.3 U4.5
VCC-5V-BUCKBOOST: R18.1
PORT: C1.2(A) C2.2(A) D1.1(C) D2.1(K) D2.2(A) Q1.2(D) Q2.2(D) R3.2 R6.2
Net-(1-1): 1.1 C12.2 R1.2 U3.1 U4.8(7)
Net-(3-1): 3.1 D1.2(A)
Net-(*1-IO5): *1.IO5 C5.1 R3.1 R4.2
Net-(*1-IO6): *1.IO6 C3.1 R1.1 R2.1
Net-(*1-IO7): *1.IO7 C7.1 R5.1 R6.1
Net-(*1-IO14): *1.IO14 C10.1 Q4.4(C)
Net-(*1-IO15): *1.IO15 ENC1.A(CHANNEL A)
Net-(*1-IO16): *1.IO16 R15.1
Net-(*1-IO17): *1.IO17 ENC1.B(CHANNEL B)
Net-(*1-IO18): *1.IO18 ENC1.1
Net-(*1-IO46): *1.IO46 D7.2(K) R7.1
Net-(C1-1): C1.1(C) C4.2(A)
Net-(C2-1): C2.1(C) C6.2(A)
Net-(C8-2): C8.2 R16.2 S1.1
Net-(C9-1): C9.1 Q4.1(A) R16.1 R17.2
Net-(C11-2): C11.2 D6.2(K) R18.2 TP1.1 U2.1
Net-(D3-1): D3.1(C) D4.2(K) D5.1(C) R8.2 R9.1 R12.1 R13.2 R14.2
Net-(D3-2): D3.2(A) Q1.1(G) R9.2
Net-(D5-2): D5.2(A) Q2.1(G) R12.2
Net-(Q5-2): Q5.2(B) R15.2
Net-(R7-2): R7.2 U4.2
Net-(R8-1): R8.1 U4.7(6)

Not connected (* = marked no-connect by the designer): *1 IO9; ENC1 3(MNT 1) 4(MNT 2); Q5 3(C); U4 1 4(GND) 6

## Notes on the sheet
- gate drive rail
- Super capacitor voltage
- Auto Sens
- D
- +
- Manual Trigger Wedling
- G
- S
- 16 to 20 mosfets
- -
- D
- G
- S
- DIY Supercapacitor Spot Welder – Inspired by AKA KASYAN, Modified Design
- A
- Hisham2630

# Schematic ESP32-S3-wroom32
Create Date: 2026-03-19; Page Name: Sheet1-with-IR4427; Project Name: MyWeld-ESP32; Schematic Name: ESP32-S3-wroom32; Update Date: 2026-03-19; Address1: *; Address2: *; Address3: *; Address4: *; Application_BuildNumber: *; ApprovedBy: *; Author: Hisham2630; CheckedBy: *; CompanyName: *; CurrentDate: *; CurrentTime: *; Date: *; DocumentFullPathAndName: *; DocumentName: *; DocumentNumber: *; DrawnBy: Hisham2630; Engineer: Hisham2630; ImagePath: *; ModifiedDate: *; Organization: *; ProjectName: *; Revision: A; Rule: *; SheetNumber: 1; SheetTotal: 1; Time: *; Title: DIY Supercapacitor Spot Welder – Inspired by AKA KASYAN, Modified Design
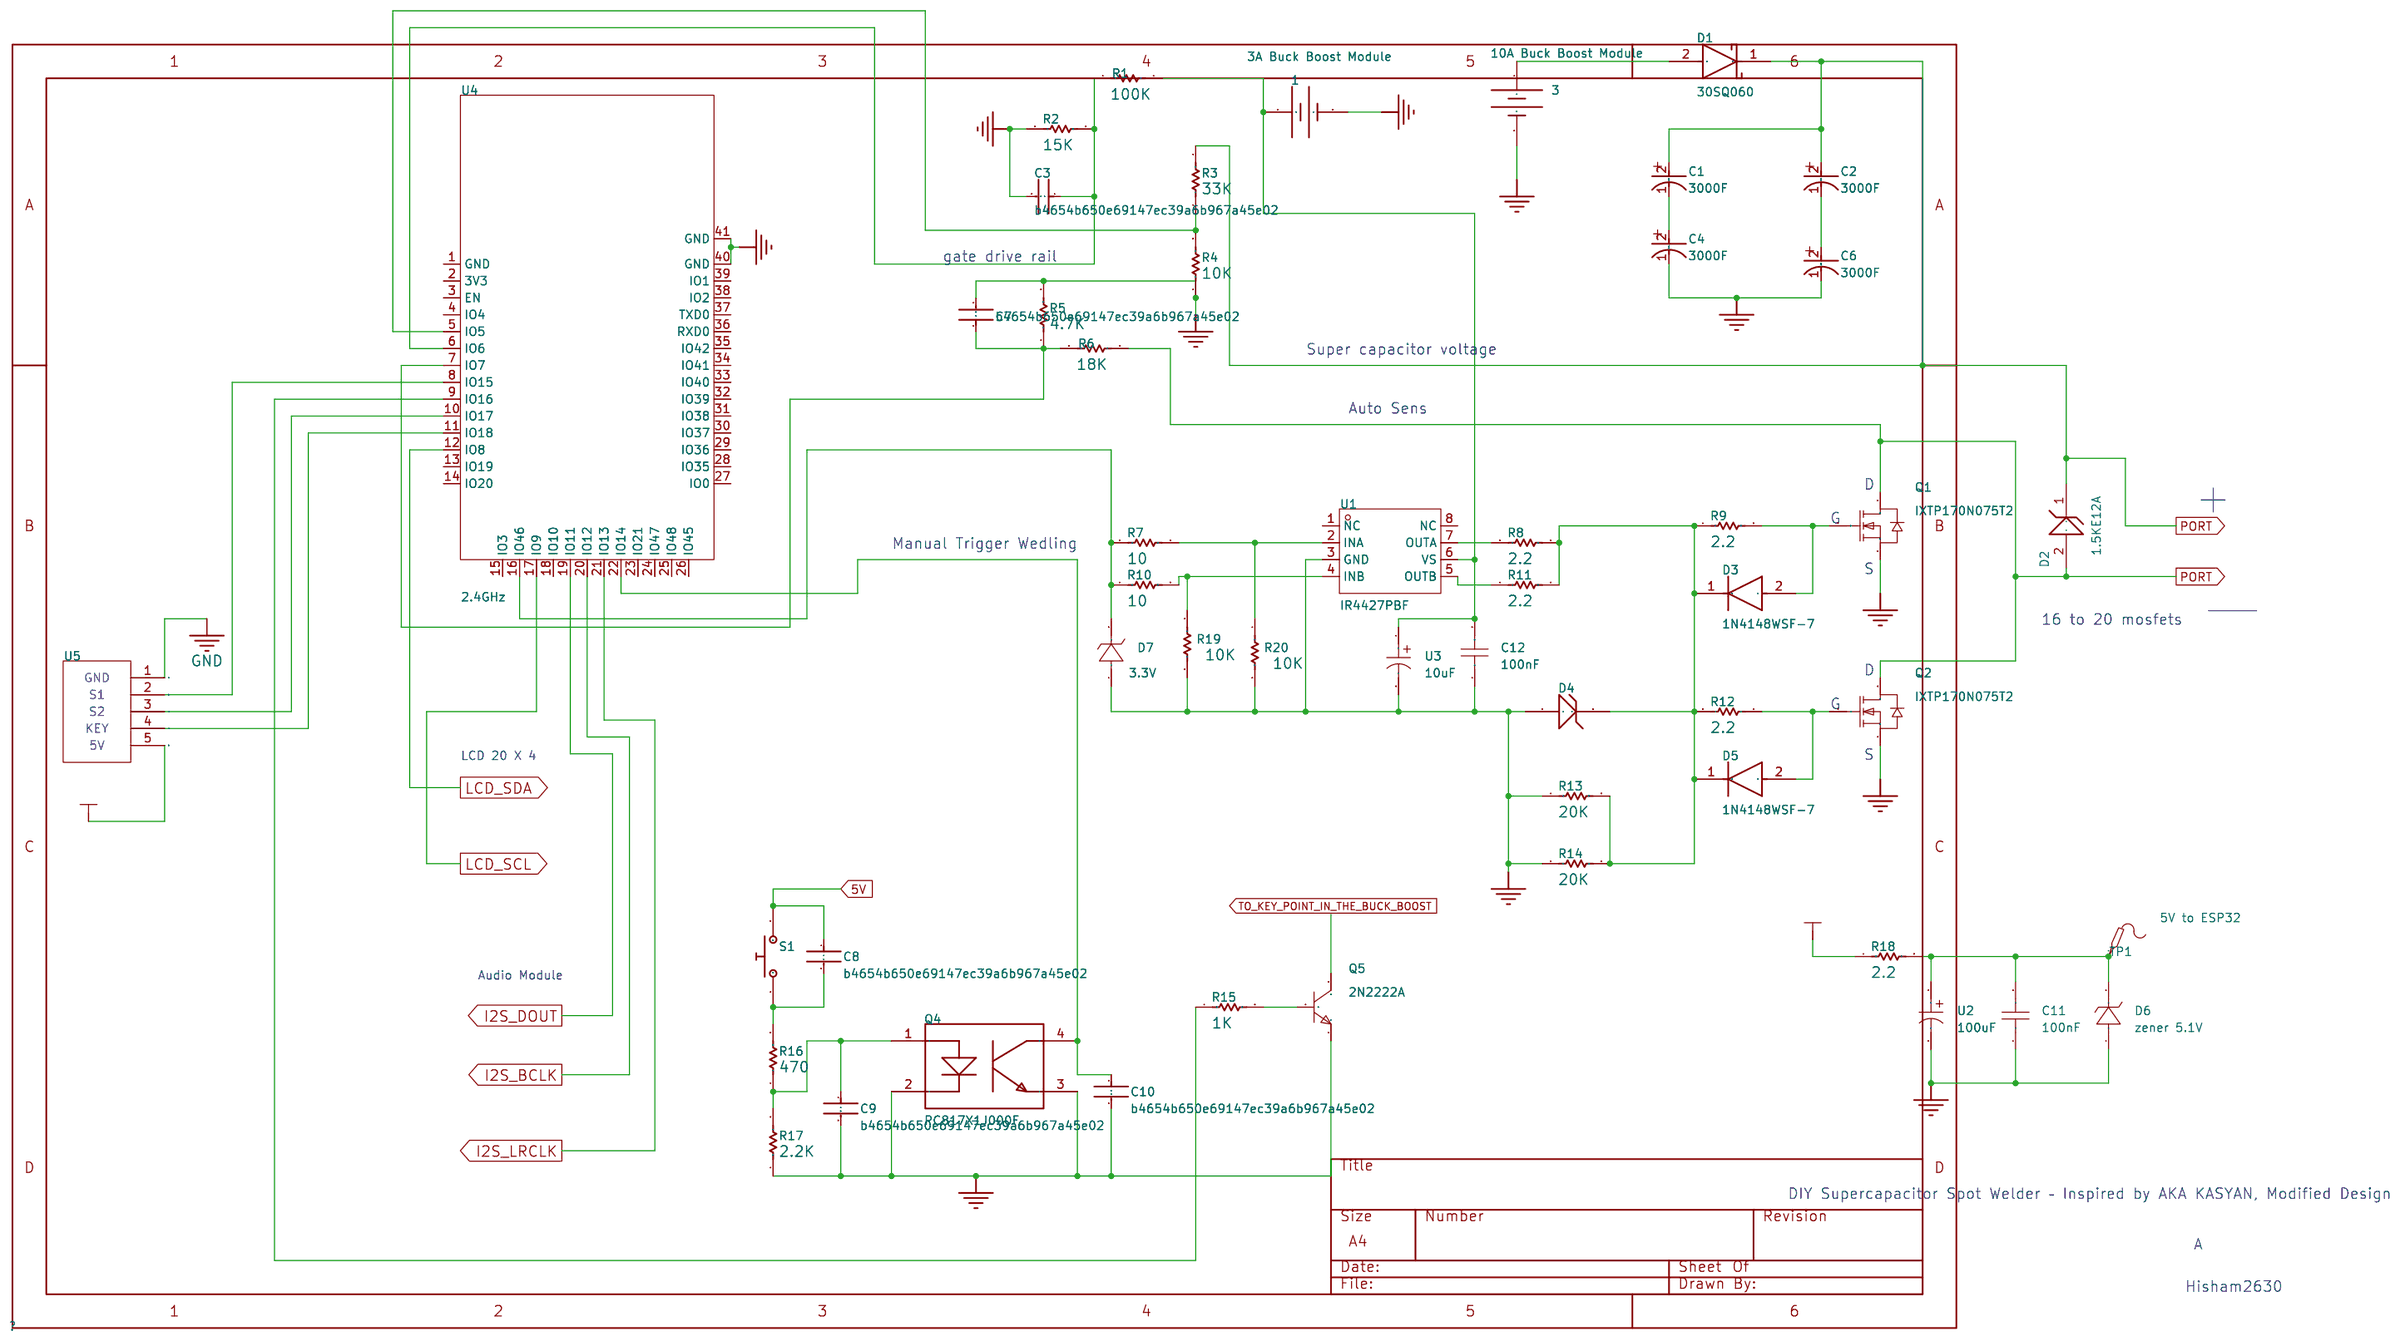
[diagram p2: schematic sheet]

## Parts
1  3A Buck Boost Module
3  10A Buck Boost Module
C1  0.47F
C2  0.47F
C3  b4654b650e69147ec39a6b967a45e02
C4  0.47F
C6  0.47F
C7  b4654b650e69147ec39a6b967a45e02
C8  b4654b650e69147ec39a6b967a45e02
C9  b4654b650e69147ec39a6b967a45e02
C10  b4654b650e69147ec39a6b967a45e02
C11  100nF  [C0402]
C12  100nF  [C0402]
D1  30SQ060
D2  1.5KE12A
D3  1.5pF
D4  Zener Diode
D5  1.5pF
D6  zener 5.1V  [LL-34_L3.5-W1.5-R-RD]
D7  3.3V  [LL-34_L3.5-W1.5-R-RD]
Q1  IXTP170N075T2  [TO-220-3_L10.0-W4.5-P2.54-L-1]
Q2  IXTP170N075T2  [TO-220-3_L10.0-W4.5-P2.54-L-1]
Q4  PC817X1J000F
Q5  2N2222A  [TO-92-3_L4.5-W3.5-P1.27-L]
R1  100K
R2  15K
R3  33K
R4  10K
R5  4.7K
R6  18K
R7  10
R8  2.2
R9  2.2
R10  10
R11  2.2
R12  2.2
R13  20K
R14  20K
R15  1K
R16  470
R17  2.2K
R18  2.2
R19  10K
R20  10K
S1  Push Button Normally Opened
TP1  5V to ESP32  [Test-Point-0.5mm]
U1  IR4427PBF  [PDIP-8_L9.6-W6.4-P2.54-LS7.6-BL]
U2  100uF  [CAP-TH_BD10.0-P5.00-D0.6-FD]
U3  10uF  [CAP-TH_BD10.0-P5.00-D0.6-FD]
U4  2.4GHz  [WIRELM-SMD_ESP32-S3-WROOM-1]
U5  -

## Library data of the parts
1 = 3A Buck Boost Module: Constant Voltage Source; SimulationGenericComponent: True; DC Magnitude: 16V; Design Item ID: Battery; Library Name: Simulation Generic Components
3 = 10A Buck Boost Module: Constant Voltage Source; SimulationGenericComponent: True; DC Magnitude: 5.7V; Design Item ID: Battery; Library Name: Simulation Generic Components
C1 C2 C4 C6 = 3000F: CAP 470MF -20% +80% 5.5V T/H; Octopart: https://octopart.com/ft0h474zf-kemet-30531665; Manufacturer: KEMET; Automotive: No; Device Class L3: Supercapacitors; Digikey Description: CAP 470MF -20% +80% 5.5V T/H; ComponentLink2Description: Datasheet; ComponentLink2URL: https://content.kemet.com/datasheets/KEM_S6014_FT.pdf; Device Class L1: Passive Components; Tolerance: -20/+80%; Manufacturer Part Number: FT0H474ZF; Height: 13mm; Category: Cap; RoHS: TRUE; Lead Free: Yes; Temperature Range Low: -40°C; Temperature: -40°C to +85°C; Voltage Rating: 5.5V; Device Class L2: Capacitors; Package1: FT0H474ZF; Mouser Description: Supercapacitors / Ultracapacitors 0.47F 5.5volts Radial Super Cap; Temperature Range High: +85°C; Design Item ID: CMP-03024-000001-1; Library Name: Altium Content Vault; Datasheet: https://content.kemet.com/datasheets/KEM_S6014_FT.pdf
C3 C7-C10 = b4654b650e69147ec39a6b967a45e02: Chip Multilayer Ceramic Capacitors for General Purpose, 0201, 0.10uF, X5R, 15%, 10%, 10V; Mount: Surface Mount; Dielectric: X5R; Width: 0.012inch; Tolerance: 10%; Radiation Hardening: No; Voltage Rating: 10V; REACH SVHC: No SVHC; Height: 0.3mm; Max Operating Temperature: 85°C; Voltage Rating (DC): 10V; Capacitance: 100nF; Thickness: 0.013inch; Termination: SMD/SMT; Lead Free: Lead Free; Package Quantity: 1; Case/Package: 0201; Min Operating Temperature: -55°C; Weight: 6E-06oz; Length: 0.6mm; Case Code (Imperial): 0201; Depth: 0.3mm; Voltage: 10V; Packaging: Tape and Reel; Case Code (Metric): 0603; Origin Footprint 1: FP-GRM033-0_03-MFG; Origin Footprint 2: FP-GRM033-0_03-IPC_B; Origin Footprint 3: FP-GRM033-0_03-IPC_A; Design Item ID: CMP-2010-01264-2; Library Name: Altium Content Vault
C11 C12 = CL05B104KB54PNC: LCSC Part Name: 100nF ±10% 50V; Supplier Part: C307331; Manufacturer: SAMSUNG(三星); Supplier Footprint: 0402; JLCPCB Part Class: Basic Part; Datasheet: https://item.szlcsc.com/datasheet/CL05B104KB54PNC/291005.html; Supplier: LCSC; Tolerance: ±10%; Voltage Rating: 50V; Temperature Coefficient: X7R
D1 = 30SQ060: DIODE SCHOTTKY 20V 1A SMAF; Average Rectified Current: 1A; Packaging: Tape and Reel; Mount: Surface Mount; Max Reverse Voltage (DC): 20V; RoHS Compliant: Yes; Design Item ID: CMP-12790-000092-1; Library Name: Altium Content Vault
D2 = 1.5KE12A: TVS diode [Würth Elektronik] 824520700 TVS diode; Packaging: Cut Tape; Min Breakdown Voltage: 8.19V; Length: 4.32mm; Number of Pins: 2; Width: 3.62mm; Height: 2.4mm; REACH SVHC: Unknown; Breakdown Voltage: 8.19V; Peak Pulse Current: 50A; RoHS: Compliant; Composition: Zener; Reverse Standoff Voltage: 7V; Power Line Protection: No; Number of Unidirectional Channels: 1; Mount: Surface Mount; Polarity: Unidirectional; Peak Pulse Power: 600W; Max Operating Temperature: 150°C; Min Operating Temperature: -65°C; Max Breakdown Voltage: 8.19V; Leakage Current: 200µA; Clamping Voltage: 12V; Design Item ID: CMP-03913-71101605-2; Library Name: Altium Content Vault
D3 D5 = 1N4148WSF-7: DIODE GEN PURP 100V 250MA SOD323; Height: 0.75mm; Digikey Description: DIODE GEN PURP 100V 250MA SOD323; Automotive: No; Footprint Url: https://www.diodes.com/assets/Package-Files/SOD323F.pdf; Category: Diode; Max Repetitive Reverse Voltage: 100V; Lead Free: Yes; Temperature Range High: +150°C; Forward Current: 250mA; Reverse Voltage: 100V; Device Class L3: Rectifier Diodes; ComponentLink2URL: https://www.diodes.com/assets/Datasheets/1N4148WSF.pdf; Package1: SOD323F; Manufacturer: Diodes Inc.; RoHS: TRUE; Mouser Description: Diodes - General Purpose, Power, Switching 200mW 2pF 75Vrrm 150mA 2A 1VF; Temperature: -55°C to +150°C; Max Surge Forward Current: 0.5A; Device Class L2: Diodes; ComponentLink2Description: Datasheet; Device Class L1: Discrete Semiconductors; Octopart: https://octopart.com/1n4148wsf-7-diodes+inc.-33798544; Peak Reverse Current: 0.5uA; Max Junction Temp: +150°C; Temperature Range Low: -55°C; Design Item ID: CMP-12791-000029-1; Library Name: Altium Content Vault; Datasheet: https://www.diodes.com/assets/Datasheets/1N4148WSF.pdf
D4 = Zener Diode: AF: 1; BV_MAX: 1e99; CJO: 0; CJP: 0; CTA: 0; CTP: 0; EG: 1.11; FC: 0.5; FCS: 0.5; FV_MAX: 1e99; IBV: 0.001; IKF: 0; IKR: 0; IS: 1e-14; ISR: 1e-14; JSW: 0; JTUN: 0; JTUNSW: 0; KEG: 1; KF: 0; LEVEL: 1; MJSW: 0.33; N: 1; NBV: 1; NR: 1; NS: 1; NTUN: 30; PHP: 1; RS: 0; TCV: 0; TLEV: 0; TLEVC: 0; TM1: 0; TM2: 0; TNOM: 27; TPB: 0; TPHP: 0; TRS: 0; TRS2: 0; TT: 0; TTT1: 0; TTT2: 0; VJ: 1; XTI: 3; XTITUN: 3; SimulationGenericComponent: True; BV: 18V Zener; Library Name: Simulation Generic Components
D6 D7 = ZMM5V1PF-M: LCSC Part Name: 耐压:5.1V 电流:0.1uA@1V; Supplier Part: C7497480; Manufacturer: ST(先科); Supplier Footprint: LL-34; JLCPCB Part Class: Extended Part; Datasheet: https://item.szlcsc.com/datasheet/ZMM5V1PF-M/8566091.html; Supplier: LCSC; Zener Voltage(Nom): 5.1V; Reverse Leakage Current (Ir): 100nA@1V; Zener Voltage(Range): 4.8V~5.4V; Pd - Power Dissipation: 500mW; Impedance(Zzt): 35Ω; Impedance(Zzk): 550Ω
Q1 Q2 = IXTP170N075T2: Supplier Part: C22419309; Manufacturer: Littelfuse/IXYS; Supplier Footprint: TO-220; JLCPCB Part Class: Extended Part; Datasheet: https://item.szlcsc.com/datasheet/IXTP170N075T2/24042949.html; Supplier: LCSC
Q4 = PC817X1J000F: OPTOISOLATOR 5KV TRANS 4DIP; Collector Emitter Saturation Voltage: 200mV; Min Operating Temperature: -30°C; Number of Pins: 4; Forward Voltage: 1.4V; Radiation Hardening: No; Power Dissipation: 200mW; Input Current: 20mA; Max Collector Current: 50mA; Collector Emitter Breakdown Voltage: 80V; Output Current per Channel: 50mA; Rise Time: 18000ns; Case/Package: DIP; Fall Time: 18000ns; Forward Current: 50mA; Isolation Voltage: 5kV; Number of Elements: 1; Package Quantity: 2000; Reverse Breakdown Voltage: 6V; Max Operating Temperature: 100°C; Packaging: Sleeve; Max Input Current: 50mA; Output Voltage: 80V; Max Power Dissipation: 200mW; Mount: Through Hole; Current Transfer Ratio: 600%; Number of Channels: 1; Collector Emitter Voltage (VCEO): 80V; Design Item ID: CMP-65434-000003-1; Library Name: Altium Content Vault
Q5 = 2N2222A_C20616319: LCSC Part Name: NPN 600mA 40V; Supplier Part: C20616319; Manufacturer: HXY MOSFET(华轩阳电子); Supplier Footprint: TO-92; JLCPCB Part Class: Extended Part; Datasheet: https://item.szlcsc.com/datasheet/2N2222A/21982678.html; Supplier: LCSC; type: NPN; Current - Collector(Ic): 600mA; Collector - Emitter Voltage VCEO: 40V; Pd - Power Dissipation: 625mW; DC Current Gain: 300@150mA,10V; Transition frequency(fT): 300MHz; Current - Collector Cutoff: 10nA; Vce Saturation(VCE(sat)): 600mV@500mA,50mA; Operating Temperature: -55℃~+150℃; Emitter-Base Voltage(Vebo): 6V; Number: 1 NPN
R1-R20 = Resistor: TC1: 0; TC2: 0; SimulationGenericComponent: True; Library Name: Simulation Generic Components
S1 = Push Button Normally Opened: closed: 0; Rclosed: 1m; Ropen: 1Meg; SimulationGenericComponent: True; Design Item ID: Push Button NO; Library Name: Simulation Generic Components
TP1 = Test-Point
U1 = IR4427PBF: Supplier Part: C1549365; Manufacturer: Infineon(英飞凌); Supplier Footprint: PDIP-8; JLCPCB Part Class: Extended Part; Datasheet: https://atta.szlcsc.com/upload/public/pdf/source/20200522/C537736_3DC1FE819CD879B59A475D2024F6FF95.pdf; Supplier: LCSC; Driven Configuration: 低边; Load Type: MOSFET；IGBT; Number of Drivers: 2; Peak Output Current(sink): 3.3A; Peak Output Current(source): 2.3A; Supply Voltage: 6V~20V; Rise Time: 15ns; Fall Time: 10ns; Operating Temperature: -40℃~+150℃@(Tj)
U2 U3 = 1000uF 16V: Supplier Part: C439782; Manufacturer: Chengx(承兴); Supplier Footprint: 插件,D10xL13mm; JLCPCB Part Class: Extended Part; Datasheet: https://item.szlcsc.com/datasheet/1000uF%252016V/438882.html; Supplier: LCSC; Voltage Rating: 16V; Ripple Current: 680mA@120Hz; Pin Spacing: 5mm; Diameter: 10mm; Height - Seated (Max): 13mm; Lifetime: 2000hrs@105℃; Operating Temperature: -40℃~+105℃
U4 = ESP32-S3-WROOM-1-N16R8: LCSC Part Name: 不带固件 通用型Wi-Fi+低功耗蓝牙MCU模组; Supplier Part: C2913202; Manufacturer: ESPRESSIF(乐鑫); Supplier Footprint: SMD,25.5x18mm; JLCPCB Part Class: Extended Part; Datasheet: https://item.szlcsc.com/datasheet/ESP32-S3-WROOM-1-N16R8/3198300.html; Supplier: LCSC; Utilized IC / Part: ESP32-S3R8; Interface Type: I2C；GPIO；UART；SPI；USB；I2S; Antenna Type: On-board PCB Antenna; Output Power: 20.5dBm; Voltage - Supply: 3V~3.6V; Receive  Current: 95mA; Send  Current: 355mA; Sensitivity: -103.5dBm; Operating Temperature: -40℃~+65℃
U5 = KY-040

## Nets
5V: C8.1 S1.2
GND: 1.2 3.2 C3.2 C4.1(C) C6.1(C) C7.2 C9.2 C10.2 C11.1 C12.1 D4.1(A) D6.1(A) D7.1(A) Q1.3(S) Q2.3(S) Q4.2(C) Q4.3(E) Q5.1(E) R2.2 R4.1 R5.2 R13.1 R14.1 R17.1 R19.2 R20.2 U1.3(GND) U2.2 U3.2 U4.40(GND) U4.41(GND) U5.1
VCC-5V-BUCKBOOST: R18.1
+3.3: U5.5
I2S_BCLK: U4.20(IO12)
I2S_DOUT: U4.19(IO11)
I2S_LRCLK: U4.21(IO13)
LCD_SCL: U4.17(IO9)
LCD_SDA: U4.12(IO8)
PORT: C1.2(A) C2.2(A) D1.1(C) D2.1(K) D2.2(A) Q1.2(D) Q2.2(D) R3.2 R6.2
Net-(1-1): 1.1 C12.2 R1.2 U1.6(VS) U3.1
Net-(3-1): 3.1 D1.2(A)
Net-(C1-1): C1.1(C) C4.2(A)
Net-(C2-1): C2.1(C) C6.2(A)
Net-(C3-1): C3.1 R1.1 R2.1 U4.6(IO6)
Net-(C7-1): C7.1 R5.1 R6.1 U4.7(IO7)
Net-(C8-2): C8.2 R16.2 S1.1
Net-(C9-1): C9.1 Q4.1(A) R16.1 R17.2
Net-(C10-1): C10.1 Q4.4(C) U4.22(IO14)
Net-(C11-2): C11.2 D6.2(K) R18.2 TP1.1 U2.1
Net-(D3-1): D3.1(C) D4.2(K) D5.1(C) R8.2 R9.1 R11.2 R12.1 R13.2 R14.2
Net-(D3-2): D3.2(A) Q1.1(G) R9.2
Net-(D5-2): D5.2(A) Q2.1(G) R12.2
Net-(D7-2): D7.2(K) R7.1 R10.1 U4.16(IO46)
Net-(Q5-2): Q5.2(B) R15.2
Net-(R3-1): R3.1 R4.2 U4.5(IO5)
Net-(R7-2): R7.2 R20.1 U1.2(INA)
Net-(R8-1): R8.1 U1.7(OUTA)
Net-(R10-2): R10.2 R19.1 U1.4(INB)
Net-(R11-1): R11.1 U1.5(OUTB)
Net-(R15-1): R15.1 U4.9(IO16)
Net-(U4-8): U4.8(IO15) U5.2
Net-(U4-10): U4.10(IO17) U5.3
Net-(U4-11): U4.11(IO18) U5.4

Not connected (* = marked no-connect by the designer): Q5 3(C); U1 1(NC) 8(NC); U4 1(GND) 2(3V3) 3(EN) 4(IO4) 13(IO19) 14(IO20) 15(IO3) 18(IO10) 23(IO21) 24(IO47) 25(IO48) 26(IO45) 27(IO0) 28(IO35) 29(IO36) 30(IO37) 31(IO38) 32(IO39) 33(IO40) 34(IO41) 35(IO42) 36(RXD0) 37(TXD0) 38(IO2) 39(IO1)

## Notes on the sheet
- gate drive rail
- Super capacitor voltage
- Auto Sens
- D
- +
- G
- Manual Trigger Wedling
- S
- 16 to 20 mosfets
- -
- D
- G
- LCD 20 X 4
- S
- Audio Module
- DIY Supercapacitor Spot Welder – Inspired by AKA KASYAN, Modified Design
- A
- Hisham2630
